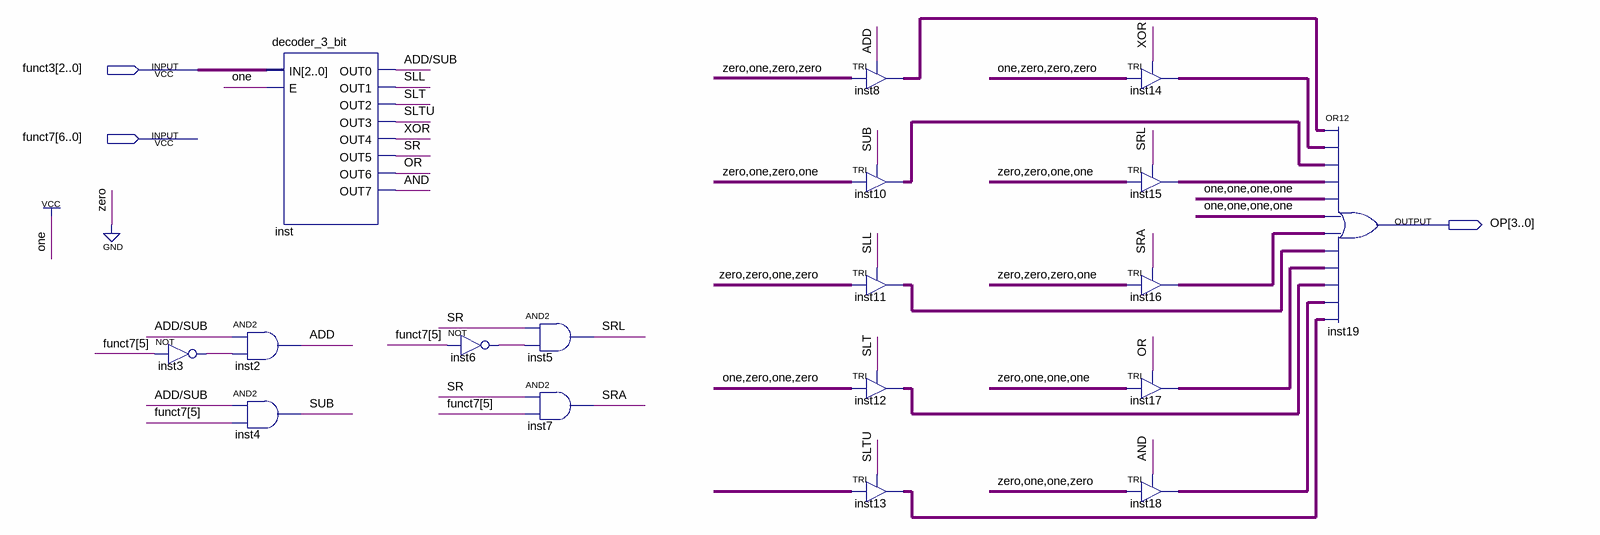
[diagram p0: schematic sheet]
// Quartus schematic aluOpCode.bdf as structural Verilog: 18 symbols, 3 pins
module aluOpCode (
  input  [2:0] funct3,
  input  [6:0] funct7,
  output [3:0] OP
);

  wire ADD, \ADD/SUB , AND, inst3_out, inst6_out, OR, SLL, SLT, SLTU, SR, SRA, SRL, SUB, XOR;
  wire [3:0] inst8_out, inst10_out, inst11_out, inst12_out, inst13_out, inst14_out, inst15_out, inst16_out,
       inst17_out, inst18_out, undriven;

  not inst3 (inst3_out, funct7[5]);
  and inst2 (ADD, \ADD/SUB , inst3_out);
  and inst4 (SUB, \ADD/SUB , funct7[5]);
  decoder_3_bit inst (
    .IN(funct3), .E(1'b1), .OUT0(\ADD/SUB ), .OUT1(SLL), .OUT2(SLT), .OUT3(SLTU), .OUT4(XOR), .OUT5(SR),
    .OUT6(OR), .OUT7(AND));
  not inst6 (inst6_out, funct7[5]);
  and inst5 (SRL, SR, inst6_out);
  and inst7 (SRA, SR, funct7[5]);
  TRI inst8[3:0] (.IN(4'b0100), .OE(ADD), .OUT(inst8_out));
  TRI inst10[3:0] (.IN(4'b0101), .OE(SUB), .OUT(inst10_out));
  TRI inst11[3:0] (.IN(4'b0010), .OE(SLL), .OUT(inst11_out));
  TRI inst12[3:0] (.IN(4'b1010), .OE(SLT), .OUT(inst12_out));
  TRI inst13[3:0] (.IN(undriven), .OE(SLTU), .OUT(inst13_out));
  TRI inst14[3:0] (.IN(4'b1000), .OE(XOR), .OUT(inst14_out));
  TRI inst15[3:0] (.IN(4'b0011), .OE(SRL), .OUT(inst15_out));
  TRI inst16[3:0] (.IN(4'b0001), .OE(SRA), .OUT(inst16_out));
  TRI inst17[3:0] (.IN(4'b0111), .OE(OR), .OUT(inst17_out));
  TRI inst18[3:0] (.IN(4'b0110), .OE(AND), .OUT(inst18_out));
  assign OP = inst8_out | inst14_out | inst10_out | inst15_out | 4'b1111 | 4'b1111 | inst16_out | inst11_out | inst17_out | inst12_out | inst18_out | inst13_out;  // OR12 inst19, 4 bits wide
endmodule
